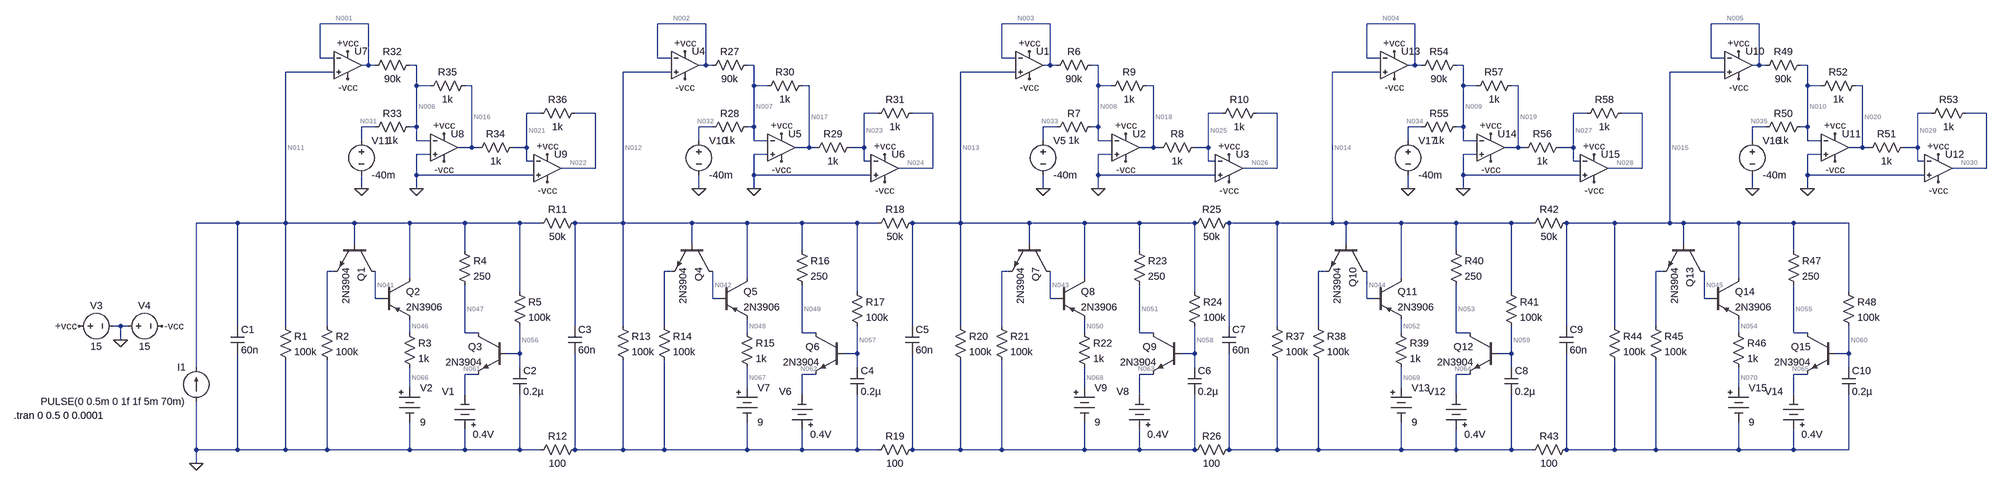
[diagram p0: schematic Modified-FitzHugh-Nagumo-Axon.asc]
Modified-FitzHugh-Nagumo-Axon.asc, the LTspice schematic file:
Version 4
SHEET 1 3572 1052
WIRE -192 -544 -304 -544
WIRE 592 -544 480 -544
WIRE 1392 -544 1280 -544
WIRE 2240 -544 2128 -544
WIRE 3040 -544 2928 -544
WIRE -304 -464 -304 -544
WIRE -272 -464 -304 -464
WIRE 480 -464 480 -544
WIRE 512 -464 480 -464
WIRE 1280 -464 1280 -544
WIRE 1312 -464 1280 -464
WIRE 2128 -464 2128 -544
WIRE 2160 -464 2128 -464
WIRE 2928 -464 2928 -544
WIRE 2960 -464 2928 -464
WIRE -192 -448 -192 -544
WIRE -192 -448 -208 -448
WIRE -176 -448 -192 -448
WIRE -80 -448 -96 -448
WIRE 592 -448 592 -544
WIRE 592 -448 576 -448
WIRE 608 -448 592 -448
WIRE 704 -448 688 -448
WIRE 1392 -448 1392 -544
WIRE 1392 -448 1376 -448
WIRE 1408 -448 1392 -448
WIRE 1504 -448 1488 -448
WIRE 2240 -448 2240 -544
WIRE 2240 -448 2224 -448
WIRE 2256 -448 2240 -448
WIRE 2352 -448 2336 -448
WIRE 3040 -448 3040 -544
WIRE 3040 -448 3024 -448
WIRE 3056 -448 3040 -448
WIRE 3152 -448 3136 -448
WIRE -272 -432 -384 -432
WIRE 512 -432 400 -432
WIRE 1312 -432 1184 -432
WIRE 2160 -432 2048 -432
WIRE 2960 -432 2832 -432
WIRE -80 -400 -80 -448
WIRE -48 -400 -80 -400
WIRE 48 -400 32 -400
WIRE 704 -400 704 -448
WIRE 736 -400 704 -400
WIRE 832 -400 816 -400
WIRE 1504 -400 1504 -448
WIRE 1536 -400 1504 -400
WIRE 1632 -400 1616 -400
WIRE 2352 -400 2352 -448
WIRE 2384 -400 2352 -400
WIRE 2480 -400 2464 -400
WIRE 3152 -400 3152 -448
WIRE 3184 -400 3152 -400
WIRE 3280 -400 3264 -400
WIRE 208 -336 176 -336
WIRE 336 -336 288 -336
WIRE 992 -336 960 -336
WIRE 1120 -336 1072 -336
WIRE 1792 -336 1760 -336
WIRE 1920 -336 1872 -336
WIRE 2640 -336 2608 -336
WIRE 2768 -336 2720 -336
WIRE 3440 -336 3408 -336
WIRE 3568 -336 3520 -336
WIRE -176 -304 -208 -304
WIRE -80 -304 -80 -400
WIRE -80 -304 -96 -304
WIRE 608 -304 576 -304
WIRE 704 -304 704 -400
WIRE 704 -304 688 -304
WIRE 1408 -304 1376 -304
WIRE 1504 -304 1504 -400
WIRE 1504 -304 1488 -304
WIRE 2256 -304 2224 -304
WIRE 2352 -304 2352 -400
WIRE 2352 -304 2336 -304
WIRE 3056 -304 3024 -304
WIRE 3152 -304 3152 -400
WIRE 3152 -304 3136 -304
WIRE -208 -272 -208 -304
WIRE -80 -272 -80 -304
WIRE -48 -272 -80 -272
WIRE 576 -272 576 -304
WIRE 704 -272 704 -304
WIRE 736 -272 704 -272
WIRE 1376 -272 1376 -304
WIRE 1504 -272 1504 -304
WIRE 1536 -272 1504 -272
WIRE 2224 -272 2224 -304
WIRE 2352 -272 2352 -304
WIRE 2384 -272 2352 -272
WIRE 3024 -272 3024 -304
WIRE 3152 -272 3152 -304
WIRE 3184 -272 3152 -272
WIRE 48 -256 48 -400
WIRE 48 -256 16 -256
WIRE 64 -256 48 -256
WIRE 176 -256 176 -336
WIRE 176 -256 144 -256
WIRE 832 -256 832 -400
WIRE 832 -256 800 -256
WIRE 848 -256 832 -256
WIRE 960 -256 960 -336
WIRE 960 -256 928 -256
WIRE 1632 -256 1632 -400
WIRE 1632 -256 1600 -256
WIRE 1648 -256 1632 -256
WIRE 1760 -256 1760 -336
WIRE 1760 -256 1728 -256
WIRE 2480 -256 2480 -400
WIRE 2480 -256 2448 -256
WIRE 2496 -256 2480 -256
WIRE 2608 -256 2608 -336
WIRE 2608 -256 2576 -256
WIRE 3280 -256 3280 -400
WIRE 3280 -256 3248 -256
WIRE 3296 -256 3280 -256
WIRE 3408 -256 3408 -336
WIRE 3408 -256 3376 -256
WIRE -48 -240 -80 -240
WIRE 736 -240 704 -240
WIRE 1536 -240 1504 -240
WIRE 2384 -240 2352 -240
WIRE 3184 -240 3152 -240
WIRE 176 -224 176 -256
WIRE 192 -224 176 -224
WIRE 960 -224 960 -256
WIRE 976 -224 960 -224
WIRE 1760 -224 1760 -256
WIRE 1776 -224 1760 -224
WIRE 2608 -224 2608 -256
WIRE 2624 -224 2608 -224
WIRE 3408 -224 3408 -256
WIRE 3424 -224 3408 -224
WIRE 336 -208 336 -336
WIRE 336 -208 256 -208
WIRE 1120 -208 1120 -336
WIRE 1120 -208 1040 -208
WIRE 1920 -208 1920 -336
WIRE 1920 -208 1840 -208
WIRE 2768 -208 2768 -336
WIRE 2768 -208 2688 -208
WIRE 3568 -208 3568 -336
WIRE 3568 -208 3488 -208
WIRE -80 -192 -80 -240
WIRE 192 -192 -80 -192
WIRE 704 -192 704 -240
WIRE 976 -192 704 -192
WIRE 1504 -192 1504 -240
WIRE 1776 -192 1504 -192
WIRE 2352 -192 2352 -240
WIRE 2624 -192 2352 -192
WIRE 3152 -192 3152 -240
WIRE 3424 -192 3152 -192
WIRE -208 -160 -208 -192
WIRE -80 -160 -80 -192
WIRE 576 -160 576 -192
WIRE 704 -160 704 -192
WIRE 1376 -160 1376 -192
WIRE 1504 -160 1504 -192
WIRE 2224 -160 2224 -192
WIRE 2352 -160 2352 -192
WIRE 3024 -160 3024 -192
WIRE 3152 -160 3152 -192
WIRE -496 -80 -592 -80
WIRE -384 -80 -384 -432
WIRE -384 -80 -496 -80
WIRE -224 -80 -384 -80
WIRE -96 -80 -224 -80
WIRE 32 -80 -96 -80
WIRE 160 -80 32 -80
WIRE 208 -80 160 -80
WIRE 400 -80 400 -432
WIRE 400 -80 288 -80
WIRE 560 -80 400 -80
WIRE 688 -80 560 -80
WIRE 816 -80 688 -80
WIRE 944 -80 816 -80
WIRE 992 -80 944 -80
WIRE 1184 -80 1184 -432
WIRE 1184 -80 1072 -80
WIRE 1344 -80 1184 -80
WIRE 1472 -80 1344 -80
WIRE 1600 -80 1472 -80
WIRE 1728 -80 1600 -80
WIRE 1920 -80 1808 -80
WIRE 2048 -80 2048 -432
WIRE 2048 -80 1920 -80
WIRE 2080 -80 2048 -80
WIRE 2208 -80 2080 -80
WIRE 2336 -80 2208 -80
WIRE 2464 -80 2336 -80
WIRE 2512 -80 2464 -80
WIRE 2704 -80 2592 -80
WIRE 2832 -80 2832 -432
WIRE 2832 -80 2704 -80
WIRE 2864 -80 2832 -80
WIRE 2992 -80 2864 -80
WIRE 3120 -80 2992 -80
WIRE 3248 -80 3120 -80
WIRE -224 -32 -224 -80
WIRE 560 -32 560 -80
WIRE 1344 -32 1344 -80
WIRE 2080 -32 2080 -80
WIRE 2864 -32 2864 -80
WIRE 32 -16 32 -80
WIRE 816 -16 816 -80
WIRE 1600 -16 1600 -80
WIRE 2336 -16 2336 -80
WIRE 3120 -16 3120 -80
WIRE -272 32 -288 32
WIRE 512 32 496 32
WIRE 1296 32 1280 32
WIRE 2032 32 2016 32
WIRE 2816 32 2800 32
WIRE -96 48 -96 -80
WIRE 688 48 688 -80
WIRE 1472 48 1472 -80
WIRE 2208 48 2208 -80
WIRE 2992 48 2992 -80
WIRE 160 80 160 -80
WIRE 944 80 944 -80
WIRE 1728 80 1728 -80
WIRE 2464 80 2464 -80
WIRE 3248 80 3248 -80
WIRE -176 96 -176 32
WIRE -160 96 -176 96
WIRE 608 96 608 32
WIRE 624 96 608 96
WIRE 1392 96 1392 32
WIRE 1408 96 1392 96
WIRE 2128 96 2128 32
WIRE 2144 96 2128 96
WIRE 2912 96 2912 32
WIRE 2928 96 2912 96
WIRE -768 160 -784 160
WIRE -752 160 -768 160
WIRE -496 160 -496 -80
WIRE -384 160 -384 -80
WIRE -288 160 -288 32
WIRE 288 160 288 -80
WIRE 400 160 400 -80
WIRE 496 160 496 32
WIRE 1072 160 1072 -80
WIRE 1184 160 1184 -80
WIRE 1280 160 1280 32
WIRE 1808 160 1808 -80
WIRE 1920 160 1920 -80
WIRE 2016 160 2016 32
WIRE 2592 160 2592 -80
WIRE 2704 160 2704 -80
WIRE 2800 160 2800 32
WIRE -96 176 -96 144
WIRE 32 176 32 64
WIRE 64 176 32 176
WIRE 688 176 688 144
WIRE 816 176 816 64
WIRE 848 176 816 176
WIRE 1472 176 1472 144
WIRE 1600 176 1600 64
WIRE 1632 176 1600 176
WIRE 2208 176 2208 144
WIRE 2336 176 2336 64
WIRE 2368 176 2336 176
WIRE 2992 176 2992 144
WIRE 3120 176 3120 64
WIRE 3152 176 3120 176
WIRE -768 192 -768 160
WIRE 160 224 160 160
WIRE 160 224 128 224
WIRE 944 224 944 160
WIRE 944 224 912 224
WIRE 1728 224 1728 160
WIRE 1728 224 1696 224
WIRE 2464 224 2464 160
WIRE 2464 224 2432 224
WIRE 3248 224 3248 160
WIRE 3248 224 3216 224
WIRE -592 256 -592 -80
WIRE 160 256 160 224
WIRE 944 256 944 224
WIRE 1728 256 1728 224
WIRE 2464 256 2464 224
WIRE 3248 256 3248 224
WIRE 64 272 32 272
WIRE 848 272 816 272
WIRE 1632 272 1600 272
WIRE 2368 272 2336 272
WIRE 3152 272 3120 272
WIRE -96 304 -96 256
WIRE 688 304 688 256
WIRE 1472 304 1472 256
WIRE 2208 304 2208 256
WIRE 2992 304 2992 256
WIRE 32 320 32 272
WIRE 816 320 816 272
WIRE 1600 320 1600 272
WIRE 2336 320 2336 272
WIRE 3120 320 3120 272
WIRE -592 448 -592 336
WIRE -496 448 -496 224
WIRE -496 448 -592 448
WIRE -384 448 -384 240
WIRE -384 448 -496 448
WIRE -288 448 -288 240
WIRE -288 448 -384 448
WIRE -96 448 -96 384
WIRE -96 448 -288 448
WIRE 32 448 32 400
WIRE 32 448 -96 448
WIRE 160 448 160 320
WIRE 160 448 32 448
WIRE 208 448 160 448
WIRE 288 448 288 224
WIRE 400 448 400 240
WIRE 400 448 288 448
WIRE 496 448 496 240
WIRE 496 448 400 448
WIRE 688 448 688 384
WIRE 688 448 496 448
WIRE 816 448 816 400
WIRE 816 448 688 448
WIRE 944 448 944 320
WIRE 944 448 816 448
WIRE 992 448 944 448
WIRE 1072 448 1072 224
WIRE 1184 448 1184 240
WIRE 1184 448 1072 448
WIRE 1280 448 1280 240
WIRE 1280 448 1184 448
WIRE 1472 448 1472 384
WIRE 1472 448 1280 448
WIRE 1600 448 1600 400
WIRE 1600 448 1472 448
WIRE 1728 448 1728 320
WIRE 1728 448 1600 448
WIRE 1808 448 1808 224
WIRE 1920 448 1920 240
WIRE 1920 448 1808 448
WIRE 2016 448 2016 240
WIRE 2016 448 1920 448
WIRE 2208 448 2208 384
WIRE 2208 448 2016 448
WIRE 2336 448 2336 400
WIRE 2336 448 2208 448
WIRE 2464 448 2464 320
WIRE 2464 448 2336 448
WIRE 2512 448 2464 448
WIRE 2592 448 2592 224
WIRE 2704 448 2704 240
WIRE 2704 448 2592 448
WIRE 2800 448 2800 240
WIRE 2800 448 2704 448
WIRE 2992 448 2992 384
WIRE 2992 448 2800 448
WIRE 3120 448 3120 400
WIRE 3120 448 2992 448
WIRE 3248 448 3248 320
WIRE 3248 448 3120 448
WIRE -592 480 -592 448
FLAG -592 480 0
FLAG -768 192 0
FLAG -864 160 +vcc
FLAG -672 160 -vcc
FLAG 1344 -480 +vcc
FLAG 1344 -416 -vcc
FLAG 1504 -160 0
FLAG 1376 -160 0
FLAG 1568 -224 -vcc
FLAG 1568 -288 +vcc
FLAG 1808 -176 -vcc
FLAG 1808 -240 +vcc
FLAG 544 -480 +vcc
FLAG 544 -416 -vcc
FLAG 704 -160 0
FLAG 576 -160 0
FLAG 768 -224 -vcc
FLAG 768 -288 +vcc
FLAG 1008 -176 -vcc
FLAG 1008 -240 +vcc
FLAG -240 -480 +vcc
FLAG -240 -416 -vcc
FLAG -80 -160 0
FLAG -208 -160 0
FLAG -16 -224 -vcc
FLAG -16 -288 +vcc
FLAG 224 -176 -vcc
FLAG 224 -240 +vcc
FLAG 2992 -480 +vcc
FLAG 2992 -416 -vcc
FLAG 3152 -160 0
FLAG 3024 -160 0
FLAG 3216 -224 -vcc
FLAG 3216 -288 +vcc
FLAG 3456 -176 -vcc
FLAG 3456 -240 +vcc
FLAG 2192 -480 +vcc
FLAG 2192 -416 -vcc
FLAG 2352 -160 0
FLAG 2224 -160 0
FLAG 2416 -224 -vcc
FLAG 2416 -288 +vcc
FLAG 2656 -176 -vcc
FLAG 2656 -240 +vcc
SYMBOL res -400 144 R0
SYMATTR InstName R1
SYMATTR Value 100k
SYMBOL res -304 144 R0
SYMATTR InstName R2
SYMATTR Value 100k
SYMBOL res -112 160 R0
SYMATTR InstName R3
SYMATTR Value 1k
SYMBOL res 16 -32 R0
SYMATTR InstName R4
SYMATTR Value 250
SYMBOL res 144 64 R0
SYMATTR InstName R5
SYMATTR Value 100k
SYMBOL cap -512 160 R0
SYMATTR InstName C1
SYMATTR Value 60n
SYMBOL cap 144 256 R0
SYMATTR InstName C2
SYMATTR Value 0.2µ
SYMBOL current -592 336 R180
WINDOW 0 24 80 Left 2
WINDOW 3 24 0 Left 2
WINDOW 123 0 0 Left 0
WINDOW 39 0 0 Left 0
SYMATTR InstName I1
SYMATTR Value PULSE(0 0.5m 0 1f 1f 5m 70m)
SYMBOL npn -176 -32 R90
SYMATTR InstName Q1
SYMATTR Value 2N3904
SYMBOL pnp -160 48 R0
SYMATTR InstName Q2
SYMATTR Value 2N3906
SYMBOL Misc\\battery 32 416 R180
WINDOW 0 24 104 Left 2
WINDOW 3 -68 4 Left 2
WINDOW 123 0 0 Left 0
WINDOW 39 0 0 Left 0
SYMATTR InstName V1
SYMATTR Value 0.4V
SYMBOL Misc\\battery -96 288 R0
WINDOW 123 0 0 Left 0
WINDOW 39 0 0 Left 0
SYMATTR InstName V2
SYMATTR Value 9
SYMBOL npn 128 176 M0
SYMATTR InstName Q3
SYMATTR Value 2N3904
SYMBOL OpAmps\\UniversalOpAmp 1344 -448 R0
SYMATTR InstName U1
SYMBOL OpAmps\\UniversalOpAmp 1568 -256 R0
SYMATTR InstName U2
SYMBOL OpAmps\\UniversalOpAmp 1808 -208 R0
SYMATTR InstName U3
SYMBOL res 1504 -464 R90
WINDOW 0 0 56 VBottom 2
WINDOW 3 32 56 VTop 2
SYMATTR InstName R6
SYMATTR Value 90k
SYMBOL res 1504 -320 R90
WINDOW 0 0 56 VBottom 2
WINDOW 3 32 56 VTop 2
SYMATTR InstName R7
SYMATTR Value 1k
SYMBOL res 1744 -272 R90
WINDOW 0 0 56 VBottom 2
WINDOW 3 32 56 VTop 2
SYMATTR InstName R8
SYMATTR Value 1k
SYMBOL res 1632 -416 R90
WINDOW 0 0 56 VBottom 2
WINDOW 3 32 56 VTop 2
SYMATTR InstName R9
SYMATTR Value 1k
SYMBOL voltage -880 160 R270
WINDOW 0 32 56 VTop 2
WINDOW 3 -32 56 VBottom 2
WINDOW 123 0 0 Left 0
WINDOW 39 0 0 Left 0
SYMATTR InstName V3
SYMATTR Value 15
SYMBOL voltage -768 160 R270
WINDOW 0 32 56 VTop 2
WINDOW 3 -32 56 VBottom 2
WINDOW 123 0 0 Left 0
WINDOW 39 0 0 Left 0
SYMATTR InstName V4
SYMATTR Value 15
SYMBOL res 1888 -352 R90
WINDOW 0 0 56 VBottom 2
WINDOW 3 32 56 VTop 2
SYMATTR InstName R10
SYMATTR Value 1k
SYMBOL voltage 1376 -288 R0
WINDOW 123 0 0 Left 0
WINDOW 39 0 0 Left 0
SYMATTR InstName V5
SYMATTR Value -40m
SYMBOL res 304 -96 R90
WINDOW 0 0 56 VBottom 2
WINDOW 3 32 56 VTop 2
SYMATTR InstName R11
SYMATTR Value 50k
SYMBOL res 304 432 R90
WINDOW 0 0 56 VBottom 2
WINDOW 3 32 56 VTop 2
SYMATTR InstName R12
SYMATTR Value 100
SYMBOL res 384 144 R0
SYMATTR InstName R13
SYMATTR Value 100k
SYMBOL res 480 144 R0
SYMATTR InstName R14
SYMATTR Value 100k
SYMBOL res 672 160 R0
SYMATTR InstName R15
SYMATTR Value 1k
SYMBOL res 800 -32 R0
SYMATTR InstName R16
SYMATTR Value 250
SYMBOL res 928 64 R0
SYMATTR InstName R17
SYMATTR Value 100k
SYMBOL cap 272 160 R0
SYMATTR InstName C3
SYMATTR Value 60n
SYMBOL cap 928 256 R0
SYMATTR InstName C4
SYMATTR Value 0.2µ
SYMBOL npn 608 -32 R90
SYMATTR InstName Q4
SYMATTR Value 2N3904
SYMBOL pnp 624 48 R0
SYMATTR InstName Q5
SYMATTR Value 2N3906
SYMBOL Misc\\battery 816 416 R180
WINDOW 0 24 104 Left 2
WINDOW 3 -68 4 Left 2
WINDOW 123 0 0 Left 0
WINDOW 39 0 0 Left 0
SYMATTR InstName V6
SYMATTR Value 0.4V
SYMBOL Misc\\battery 688 288 R0
WINDOW 123 0 0 Left 0
WINDOW 39 0 0 Left 0
SYMATTR InstName V7
SYMATTR Value 9
SYMBOL npn 912 176 M0
SYMATTR InstName Q6
SYMATTR Value 2N3904
SYMBOL res 1088 -96 R90
WINDOW 0 0 56 VBottom 2
WINDOW 3 32 56 VTop 2
SYMATTR InstName R18
SYMATTR Value 50k
SYMBOL res 1088 432 R90
WINDOW 0 0 56 VBottom 2
WINDOW 3 32 56 VTop 2
SYMATTR InstName R19
SYMATTR Value 100
SYMBOL res 1168 144 R0
SYMATTR InstName R20
SYMATTR Value 100k
SYMBOL res 1264 144 R0
SYMATTR InstName R21
SYMATTR Value 100k
SYMBOL res 1456 160 R0
SYMATTR InstName R22
SYMATTR Value 1k
SYMBOL res 1584 -32 R0
SYMATTR InstName R23
SYMATTR Value 250
SYMBOL res 1712 64 R0
SYMATTR InstName R24
SYMATTR Value 100k
SYMBOL cap 1056 160 R0
SYMATTR InstName C5
SYMATTR Value 60n
SYMBOL cap 1712 256 R0
SYMATTR InstName C6
SYMATTR Value 0.2µ
SYMBOL npn 1392 -32 R90
SYMATTR InstName Q7
SYMATTR Value 2N3904
SYMBOL pnp 1408 48 R0
SYMATTR InstName Q8
SYMATTR Value 2N3906
SYMBOL Misc\\battery 1600 416 R180
WINDOW 0 24 104 Left 2
WINDOW 3 -68 4 Left 2
WINDOW 123 0 0 Left 0
WINDOW 39 0 0 Left 0
SYMATTR InstName V8
SYMATTR Value 0.4V
SYMBOL Misc\\battery 1472 288 R0
WINDOW 123 0 0 Left 0
WINDOW 39 0 0 Left 0
SYMATTR InstName V9
SYMATTR Value 9
SYMBOL npn 1696 176 M0
SYMATTR InstName Q9
SYMATTR Value 2N3904
SYMBOL OpAmps\\UniversalOpAmp 544 -448 R0
SYMATTR InstName U4
SYMBOL OpAmps\\UniversalOpAmp 768 -256 R0
SYMATTR InstName U5
SYMBOL OpAmps\\UniversalOpAmp 1008 -208 R0
SYMATTR InstName U6
SYMBOL res 704 -464 R90
WINDOW 0 0 56 VBottom 2
WINDOW 3 32 56 VTop 2
SYMATTR InstName R27
SYMATTR Value 90k
SYMBOL res 704 -320 R90
WINDOW 0 0 56 VBottom 2
WINDOW 3 32 56 VTop 2
SYMATTR InstName R28
SYMATTR Value 1k
SYMBOL res 944 -272 R90
WINDOW 0 0 56 VBottom 2
WINDOW 3 32 56 VTop 2
SYMATTR InstName R29
SYMATTR Value 1k
SYMBOL res 832 -416 R90
WINDOW 0 0 56 VBottom 2
WINDOW 3 32 56 VTop 2
SYMATTR InstName R30
SYMATTR Value 1k
SYMBOL res 1088 -352 R90
WINDOW 0 0 56 VBottom 2
WINDOW 3 32 56 VTop 2
SYMATTR InstName R31
SYMATTR Value 1k
SYMBOL voltage 576 -288 R0
WINDOW 123 0 0 Left 0
WINDOW 39 0 0 Left 0
SYMATTR InstName V10
SYMATTR Value -40m
SYMBOL OpAmps\\UniversalOpAmp -240 -448 R0
SYMATTR InstName U7
SYMBOL OpAmps\\UniversalOpAmp -16 -256 R0
SYMATTR InstName U8
SYMBOL OpAmps\\UniversalOpAmp 224 -208 R0
SYMATTR InstName U9
SYMBOL res -80 -464 R90
WINDOW 0 0 56 VBottom 2
WINDOW 3 32 56 VTop 2
SYMATTR InstName R32
SYMATTR Value 90k
SYMBOL res -80 -320 R90
WINDOW 0 0 56 VBottom 2
WINDOW 3 32 56 VTop 2
SYMATTR InstName R33
SYMATTR Value 1k
SYMBOL res 160 -272 R90
WINDOW 0 0 56 VBottom 2
WINDOW 3 32 56 VTop 2
SYMATTR InstName R34
SYMATTR Value 1k
SYMBOL res 48 -416 R90
WINDOW 0 0 56 VBottom 2
WINDOW 3 32 56 VTop 2
SYMATTR InstName R35
SYMATTR Value 1k
SYMBOL res 304 -352 R90
WINDOW 0 0 56 VBottom 2
WINDOW 3 32 56 VTop 2
SYMATTR InstName R36
SYMATTR Value 1k
SYMBOL voltage -208 -288 R0
WINDOW 123 0 0 Left 0
WINDOW 39 0 0 Left 0
SYMATTR InstName V11
SYMATTR Value -40m
SYMBOL res 1824 -96 R90
WINDOW 0 0 56 VBottom 2
WINDOW 3 32 56 VTop 2
SYMATTR InstName R25
SYMATTR Value 50k
SYMBOL res 1824 432 R90
WINDOW 0 0 56 VBottom 2
WINDOW 3 32 56 VTop 2
SYMATTR InstName R26
SYMATTR Value 100
SYMBOL res 1904 144 R0
SYMATTR InstName R37
SYMATTR Value 100k
SYMBOL res 2000 144 R0
SYMATTR InstName R38
SYMATTR Value 100k
SYMBOL res 2192 160 R0
SYMATTR InstName R39
SYMATTR Value 1k
SYMBOL res 2320 -32 R0
SYMATTR InstName R40
SYMATTR Value 250
SYMBOL res 2448 64 R0
SYMATTR InstName R41
SYMATTR Value 100k
SYMBOL cap 1792 160 R0
SYMATTR InstName C7
SYMATTR Value 60n
SYMBOL cap 2448 256 R0
SYMATTR InstName C8
SYMATTR Value 0.2µ
SYMBOL npn 2128 -32 R90
SYMATTR InstName Q10
SYMATTR Value 2N3904
SYMBOL pnp 2144 48 R0
SYMATTR InstName Q11
SYMATTR Value 2N3906
SYMBOL Misc\\battery 2336 416 R180
WINDOW 0 24 104 Left 2
WINDOW 3 -68 4 Left 2
WINDOW 123 0 0 Left 0
WINDOW 39 0 0 Left 0
SYMATTR InstName V12
SYMATTR Value 0.4V
SYMBOL Misc\\battery 2208 288 R0
WINDOW 123 0 0 Left 0
WINDOW 39 0 0 Left 0
SYMATTR InstName V13
SYMATTR Value 9
SYMBOL npn 2432 176 M0
SYMATTR InstName Q12
SYMATTR Value 2N3904
SYMBOL res 2608 -96 R90
WINDOW 0 0 56 VBottom 2
WINDOW 3 32 56 VTop 2
SYMATTR InstName R42
SYMATTR Value 50k
SYMBOL res 2608 432 R90
WINDOW 0 0 56 VBottom 2
WINDOW 3 32 56 VTop 2
SYMATTR InstName R43
SYMATTR Value 100
SYMBOL res 2688 144 R0
SYMATTR InstName R44
SYMATTR Value 100k
SYMBOL res 2784 144 R0
SYMATTR InstName R45
SYMATTR Value 100k
SYMBOL res 2976 160 R0
SYMATTR InstName R46
SYMATTR Value 1k
SYMBOL res 3104 -32 R0
SYMATTR InstName R47
SYMATTR Value 250
SYMBOL res 3232 64 R0
SYMATTR InstName R48
SYMATTR Value 100k
SYMBOL cap 2576 160 R0
SYMATTR InstName C9
SYMATTR Value 60n
SYMBOL cap 3232 256 R0
SYMATTR InstName C10
SYMATTR Value 0.2µ
SYMBOL npn 2912 -32 R90
SYMATTR InstName Q13
SYMATTR Value 2N3904
SYMBOL pnp 2928 48 R0
SYMATTR InstName Q14
SYMATTR Value 2N3906
SYMBOL Misc\\battery 3120 416 R180
WINDOW 0 24 104 Left 2
WINDOW 3 -68 4 Left 2
WINDOW 123 0 0 Left 0
WINDOW 39 0 0 Left 0
SYMATTR InstName V14
SYMATTR Value 0.4V
SYMBOL Misc\\battery 2992 288 R0
WINDOW 123 0 0 Left 0
WINDOW 39 0 0 Left 0
SYMATTR InstName V15
SYMATTR Value 9
SYMBOL npn 3216 176 M0
SYMATTR InstName Q15
SYMATTR Value 2N3904
SYMBOL OpAmps\\UniversalOpAmp 2992 -448 R0
SYMATTR InstName U10
SYMBOL OpAmps\\UniversalOpAmp 3216 -256 R0
SYMATTR InstName U11
SYMBOL OpAmps\\UniversalOpAmp 3456 -208 R0
SYMATTR InstName U12
SYMBOL res 3152 -464 R90
WINDOW 0 0 56 VBottom 2
WINDOW 3 32 56 VTop 2
SYMATTR InstName R49
SYMATTR Value 90k
SYMBOL res 3152 -320 R90
WINDOW 0 0 56 VBottom 2
WINDOW 3 32 56 VTop 2
SYMATTR InstName R50
SYMATTR Value 1k
SYMBOL res 3392 -272 R90
WINDOW 0 0 56 VBottom 2
WINDOW 3 32 56 VTop 2
SYMATTR InstName R51
SYMATTR Value 1k
SYMBOL res 3280 -416 R90
WINDOW 0 0 56 VBottom 2
WINDOW 3 32 56 VTop 2
SYMATTR InstName R52
SYMATTR Value 1k
SYMBOL res 3536 -352 R90
WINDOW 0 0 56 VBottom 2
WINDOW 3 32 56 VTop 2
SYMATTR InstName R53
SYMATTR Value 1k
SYMBOL voltage 3024 -288 R0
WINDOW 123 0 0 Left 0
WINDOW 39 0 0 Left 0
SYMATTR InstName V16
SYMATTR Value -40m
SYMBOL OpAmps\\UniversalOpAmp 2192 -448 R0
SYMATTR InstName U13
SYMBOL OpAmps\\UniversalOpAmp 2416 -256 R0
SYMATTR InstName U14
SYMBOL OpAmps\\UniversalOpAmp 2656 -208 R0
SYMATTR InstName U15
SYMBOL res 2352 -464 R90
WINDOW 0 0 56 VBottom 2
WINDOW 3 32 56 VTop 2
SYMATTR InstName R54
SYMATTR Value 90k
SYMBOL res 2352 -320 R90
WINDOW 0 0 56 VBottom 2
WINDOW 3 32 56 VTop 2
SYMATTR InstName R55
SYMATTR Value 1k
SYMBOL res 2592 -272 R90
WINDOW 0 0 56 VBottom 2
WINDOW 3 32 56 VTop 2
SYMATTR InstName R56
SYMATTR Value 1k
SYMBOL res 2480 -416 R90
WINDOW 0 0 56 VBottom 2
WINDOW 3 32 56 VTop 2
SYMATTR InstName R57
SYMATTR Value 1k
SYMBOL res 2736 -352 R90
WINDOW 0 0 56 VBottom 2
WINDOW 3 32 56 VTop 2
SYMATTR InstName R58
SYMATTR Value 1k
SYMBOL voltage 2224 -288 R0
WINDOW 123 0 0 Left 0
WINDOW 39 0 0 Left 0
SYMATTR InstName V17
SYMATTR Value -40m
TEXT -1016 368 Left 2 !.tran 0 0.5 0 0.0001

The netlist it stands for:
* Modified-FitzHugh-Nagumo-Axon.asc
R1 N011 0 100k
R2 N036 0 100k
R3 N046 N066 1k
R4 N011 N047 250
R5 N011 N056 100k
C1 N011 0 60n
C2 N056 0 0.2µ
I1 0 N011 PULSE(0 0.5m 0 1f 1f 5m 70m)
Q1 N041 N011 N036 0 2N3904
Q2 N011 N041 N046 0 2N3906
V1 0 N061 0.4V
V2 N066 0 9
Q3 N047 N056 N061 0 2N3904
XU1 N013 N003 +vcc -vcc N003 level1 Avol=1Meg GBW=10Meg Vos=0 En=0 Enk=0 In=0 Ink=0 Rin=500Meg  ; pins In+ In- V+ V- OUT
XU2 0 N008 +vcc -vcc N018 level1 Avol=1Meg GBW=10Meg Vos=0 En=0 Enk=0 In=0 Ink=0 Rin=500Meg  ; pins In+ In- V+ V- OUT
XU3 0 N025 +vcc -vcc N026 level1 Avol=1Meg GBW=10Meg Vos=0 En=0 Enk=0 In=0 Ink=0 Rin=500Meg  ; pins In+ In- V+ V- OUT
R6 N008 N003 90k
R7 N008 N033 1k
R8 N025 N018 1k
R9 N018 N008 1k
V3 +vcc 0 15
V4 0 -vcc 15
R10 N026 N025 1k
V5 N033 0 -40m
R11 N012 N011 50k
R12 N071 0 100
R13 N012 N071 100k
R14 N037 N071 100k
R15 N048 N067 1k
R16 N012 N049 250
R17 N012 N057 100k
C3 N012 N071 60n
C4 N057 N071 0.2µ
Q4 N042 N012 N037 0 2N3904
Q5 N012 N042 N048 0 2N3906
V6 N071 N062 0.4V
V7 N067 N071 9
Q6 N049 N057 N062 0 2N3904
R18 N013 N012 50k
R19 N072 N071 100
R20 N013 N072 100k
R21 N038 N072 100k
R22 N050 N068 1k
R23 N013 N051 250
R24 N013 N058 100k
C5 N013 N072 60n
C6 N058 N072 0.2µ
Q7 N043 N013 N038 0 2N3904
Q8 N013 N043 N050 0 2N3906
V8 N072 N063 0.4V
V9 N068 N072 9
Q9 N051 N058 N063 0 2N3904
XU4 N012 N002 +vcc -vcc N002 level1 Avol=1Meg GBW=10Meg Vos=0 En=0 Enk=0 In=0 Ink=0 Rin=500Meg  ; pins In+ In- V+ V- OUT
XU5 0 N007 +vcc -vcc N017 level1 Avol=1Meg GBW=10Meg Vos=0 En=0 Enk=0 In=0 Ink=0 Rin=500Meg  ; pins In+ In- V+ V- OUT
XU6 0 N023 +vcc -vcc N024 level1 Avol=1Meg GBW=10Meg Vos=0 En=0 Enk=0 In=0 Ink=0 Rin=500Meg  ; pins In+ In- V+ V- OUT
R27 N007 N002 90k
R28 N007 N032 1k
R29 N023 N017 1k
R30 N017 N007 1k
R31 N024 N023 1k
V10 N032 0 -40m
XU7 N011 N001 +vcc -vcc N001 level1 Avol=1Meg GBW=10Meg Vos=0 En=0 Enk=0 In=0 Ink=0 Rin=500Meg  ; pins In+ In- V+ V- OUT
XU8 0 N006 +vcc -vcc N016 level1 Avol=1Meg GBW=10Meg Vos=0 En=0 Enk=0 In=0 Ink=0 Rin=500Meg  ; pins In+ In- V+ V- OUT
XU9 0 N021 +vcc -vcc N022 level1 Avol=1Meg GBW=10Meg Vos=0 En=0 Enk=0 In=0 Ink=0 Rin=500Meg  ; pins In+ In- V+ V- OUT
R32 N006 N001 90k
R33 N006 N031 1k
R34 N021 N016 1k
R35 N016 N006 1k
R36 N022 N021 1k
V11 N031 0 -40m
R25 N014 N013 50k
R26 N073 N072 100
R37 N014 N073 100k
R38 N039 N073 100k
R39 N052 N069 1k
R40 N014 N053 250
R41 N014 N059 100k
C7 N014 N073 60n
C8 N059 N073 0.2µ
Q10 N044 N014 N039 0 2N3904
Q11 N014 N044 N052 0 2N3906
V12 N073 N064 0.4V
V13 N069 N073 9
Q12 N053 N059 N064 0 2N3904
R42 N015 N014 50k
R43 N074 N073 100
R44 N015 N074 100k
R45 N040 N074 100k
R46 N054 N070 1k
R47 N015 N055 250
R48 N015 N060 100k
C9 N015 N074 60n
C10 N060 N074 0.2µ
Q13 N045 N015 N040 0 2N3904
Q14 N015 N045 N054 0 2N3906
V14 N074 N065 0.4V
V15 N070 N074 9
Q15 N055 N060 N065 0 2N3904
XU10 N015 N005 +vcc -vcc N005 level1 Avol=1Meg GBW=10Meg Vos=0 En=0 Enk=0 In=0 Ink=0 Rin=500Meg  ; pins In+ In- V+ V- OUT
XU11 0 N010 +vcc -vcc N020 level1 Avol=1Meg GBW=10Meg Vos=0 En=0 Enk=0 In=0 Ink=0 Rin=500Meg  ; pins In+ In- V+ V- OUT
XU12 0 N029 +vcc -vcc N030 level1 Avol=1Meg GBW=10Meg Vos=0 En=0 Enk=0 In=0 Ink=0 Rin=500Meg  ; pins In+ In- V+ V- OUT
R49 N010 N005 90k
R50 N010 N035 1k
R51 N029 N020 1k
R52 N020 N010 1k
R53 N030 N029 1k
V16 N035 0 -40m
XU13 N014 N004 +vcc -vcc N004 level1 Avol=1Meg GBW=10Meg Vos=0 En=0 Enk=0 In=0 Ink=0 Rin=500Meg  ; pins In+ In- V+ V- OUT
XU14 0 N009 +vcc -vcc N019 level1 Avol=1Meg GBW=10Meg Vos=0 En=0 Enk=0 In=0 Ink=0 Rin=500Meg  ; pins In+ In- V+ V- OUT
XU15 0 N027 +vcc -vcc N028 level1 Avol=1Meg GBW=10Meg Vos=0 En=0 Enk=0 In=0 Ink=0 Rin=500Meg  ; pins In+ In- V+ V- OUT
R54 N009 N004 90k
R55 N009 N034 1k
R56 N027 N019 1k
R57 N019 N009 1k
R58 N028 N027 1k
V17 N034 0 -40m
.model NPN NPN
.model PNP PNP
.lib standard.bjt
.tran 0 0.5 0 0.0001
.lib UniversalOpAmp1.lib
.backanno
.end

* Results of the author's LTspice run, read from the files saved beside the schematic
* Operating Point, zero values left out:
*   V(n011) = -4.083 mV
*   V(n046) = 9 V
*   V(n066) = 9 V
*   V(n047) = -4.095 mV
*   V(n056) = -4.098 mV
*   V(n041) = 8.67 V
*   V(n061) = -400 mV
*   V(n003) = -4.083 mV
*   V(n013) = -4.083 mV
*   V(+vcc) = 15 V
*   V(-vcc) = -15 V
*   V(n008) = -40.05 nV
*   V(n018) = 40.05 mV
*   V(n025) = 40.05 nV
*   V(n026) = -40.05 mV
*   V(n033) = -40 mV
*   V(n012) = -4.083 mV
*   V(n048) = 9 V
*   V(n067) = 9 V
*   V(n049) = -4.094 mV
*   V(n057) = -4.098 mV
*   V(n042) = 8.67 V
*   V(n062) = -400 mV
*   V(n050) = 9 V
*   V(n068) = 9 V
*   V(n051) = -4.095 mV
*   V(n058) = -4.098 mV
*   V(n043) = 8.67 V
*   V(n063) = -400 mV
*   V(n002) = -4.083 mV
*   V(n007) = -40.05 nV
*   V(n017) = 40.05 mV
*   V(n023) = 40.05 nV
*   V(n024) = -40.05 mV
*   V(n032) = -40 mV
*   V(n001) = -4.083 mV
*   V(n006) = -40.05 nV
*   V(n016) = 40.05 mV
*   V(n021) = 40.05 nV
*   V(n022) = -40.05 mV
*   V(n031) = -40 mV
*   V(n014) = -4.083 mV
*   V(n052) = 9 V
*   V(n069) = 9 V
*   V(n053) = -4.094 mV
*   V(n059) = -4.098 mV
*   V(n044) = 8.67 V
*   V(n064) = -400 mV
*   V(n015) = -4.083 mV
*   V(n054) = 9 V
*   V(n070) = 9 V
*   V(n055) = -4.094 mV
*   V(n060) = -4.098 mV
*   V(n045) = 8.67 V
*   V(n065) = -400 mV
*   V(n005) = -4.083 mV
*   V(n010) = -40.05 nV
*   V(n020) = 40.05 mV
*   V(n029) = 40.05 nV
*   V(n030) = -40.05 mV
*   V(n035) = -40 mV
*   V(n004) = -4.083 mV
*   V(n009) = -40.05 nV
*   V(n019) = 40.05 mV
*   V(n027) = 40.05 nV
*   V(n028) = -40.05 mV
*   V(n034) = -40 mV
*   Ic(Q14) = -3.713 nA
*   Ib(Q14) = -8.694 pA
*   Ie(Q14) = 3.721 nA
*   Ic(Q11) = -3.713 nA
*   Ib(Q11) = -8.694 pA
*   Ie(Q11) = 3.721 nA
*   Ic(Q8) = -3.711 nA
*   Ib(Q8) = -8.685 pA
*   Ie(Q8) = 3.719 nA
*   Ic(Q5) = -3.714 nA
*   Ib(Q5) = -8.698 pA
*   Ie(Q5) = 3.722 nA
*   Ic(Q2) = -3.711 nA
*   Ib(Q2) = -8.687 pA
*   Ie(Q2) = 3.72 nA
*   Ic(Q15) = 44.41 nA
*   Ib(Q15) = 148.4 pA
*   Ie(Q15) = -44.56 nA
*   Ic(Q13) = 8.686 pA
*   Ib(Q13) = -8.681 pA
*   Ic(Q12) = 44.41 nA
*   Ib(Q12) = 148.4 pA
*   Ie(Q12) = -44.56 nA
*   Ic(Q10) = 8.686 pA
*   Ib(Q10) = -8.681 pA
*   Ic(Q9) = 44.41 nA
*   Ib(Q9) = 148.4 pA
*   Ie(Q9) = -44.56 nA
*   Ic(Q7) = 8.669 pA
*   Ib(Q7) = -8.681 pA
*   Ic(Q6) = 44.41 nA
*   Ib(Q6) = 148.4 pA
*   Ie(Q6) = -44.56 nA
*   Ic(Q4) = 8.686 pA
*   Ib(Q4) = -8.681 pA
*   Ic(Q3) = 44.41 nA
*   Ib(Q3) = 148.4 pA
*   Ie(Q3) = -44.56 nA
*   Ic(Q1) = 8.686 pA
*   Ib(Q1) = -8.681 pA
*   I(R58) = -40.05 µA
*   I(R57) = 40.05 µA
*   I(R56) = -40.05 µA
*   I(R55) = 40 µA
*   I(R54) = 45.37 nA
*   I(R53) = -40.05 µA
*   I(R52) = 40.05 µA
*   I(R51) = -40.05 µA
*   I(R50) = 40 µA
*   I(R49) = 45.37 nA
*   I(R48) = 148.4 pA
*   I(R47) = 44.41 nA
*   I(R46) = -3.721 nA
*   I(R44) = -40.83 nA
*   I(R43) = 7.912 pA
*   I(R41) = 148.4 pA
*   I(R40) = 44.41 nA
*   I(R39) = -3.721 nA
*   I(R37) = -40.83 nA
*   I(R26) = 15.69 pA
*   I(R36) = -40.05 µA
*   I(R35) = 40.05 µA
*   I(R34) = -40.05 µA
*   I(R33) = 40 µA
*   I(R32) = 45.37 nA
*   I(R31) = -40.05 µA
*   I(R30) = 40.05 µA
*   I(R29) = -40.05 µA
*   I(R28) = 40 µA
*   I(R27) = 45.37 nA
*   I(R24) = 148.4 pA
*   I(R23) = 44.41 nA
*   I(R22) = -3.719 nA
*   I(R20) = -40.83 nA
*   I(R19) = 25.07 pA
*   I(R17) = 148.4 pA
*   I(R16) = 44.41 nA
*   I(R15) = -3.722 nA
*   I(R13) = -40.83 nA
*   I(R12) = 31.94 pA
*   I(R10) = -40.05 µA
*   I(R9) = 40.05 µA
*   I(R8) = -40.05 µA
*   I(R7) = 40 µA
*   I(R6) = 45.37 nA
*   I(R5) = 148.4 pA
*   I(R4) = 44.41 nA
*   I(R3) = -3.72 nA
*   I(R1) = -40.83 nA
*   I(V17) = 40 µA
*   I(V16) = 40 µA
*   I(V15) = -3.721 nA
*   I(V14) = -44.56 nA
*   I(V13) = -3.721 nA
*   I(V12) = -44.56 nA
*   I(V11) = 40 µA
*   I(V10) = 40 µA
*   I(V9) = -3.719 nA
*   I(V8) = -44.56 nA
*   I(V7) = -3.722 nA
*   I(V6) = -44.56 nA
*   I(V5) = 40 µA
*   I(V4) = -450 nA
*   I(V3) = -450 nA
*   I(V2) = -3.72 nA
*   I(V1) = -44.56 nA